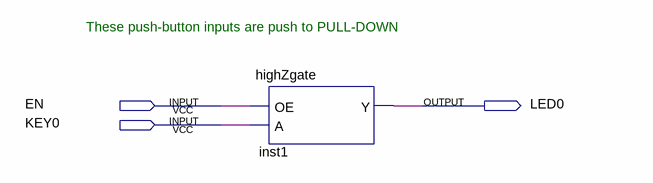
[diagram p0: schematic sheet]
// Quartus schematic comb_logic.bdf as structural Verilog: 1 symbols, 3 pins
module comb_logic (
  input  EN,
  input  KEY0,
  output LED0
);

  highZgate inst1 (.OE(EN), .A(KEY0), .Y(LED0));

  // Notes on the sheet:
  //   These push-button inputs are push to PULL-DOWN
endmodule
